# EasyEDA schematic SCH_stewart-platform.json

## Sheets
1 Sheet_1: TITLE: Sheet_1; REV: 1.0; Date: 2022-06-21; Sheet: 1/1; Drawn By: Sammy Oina; Company: Your Company
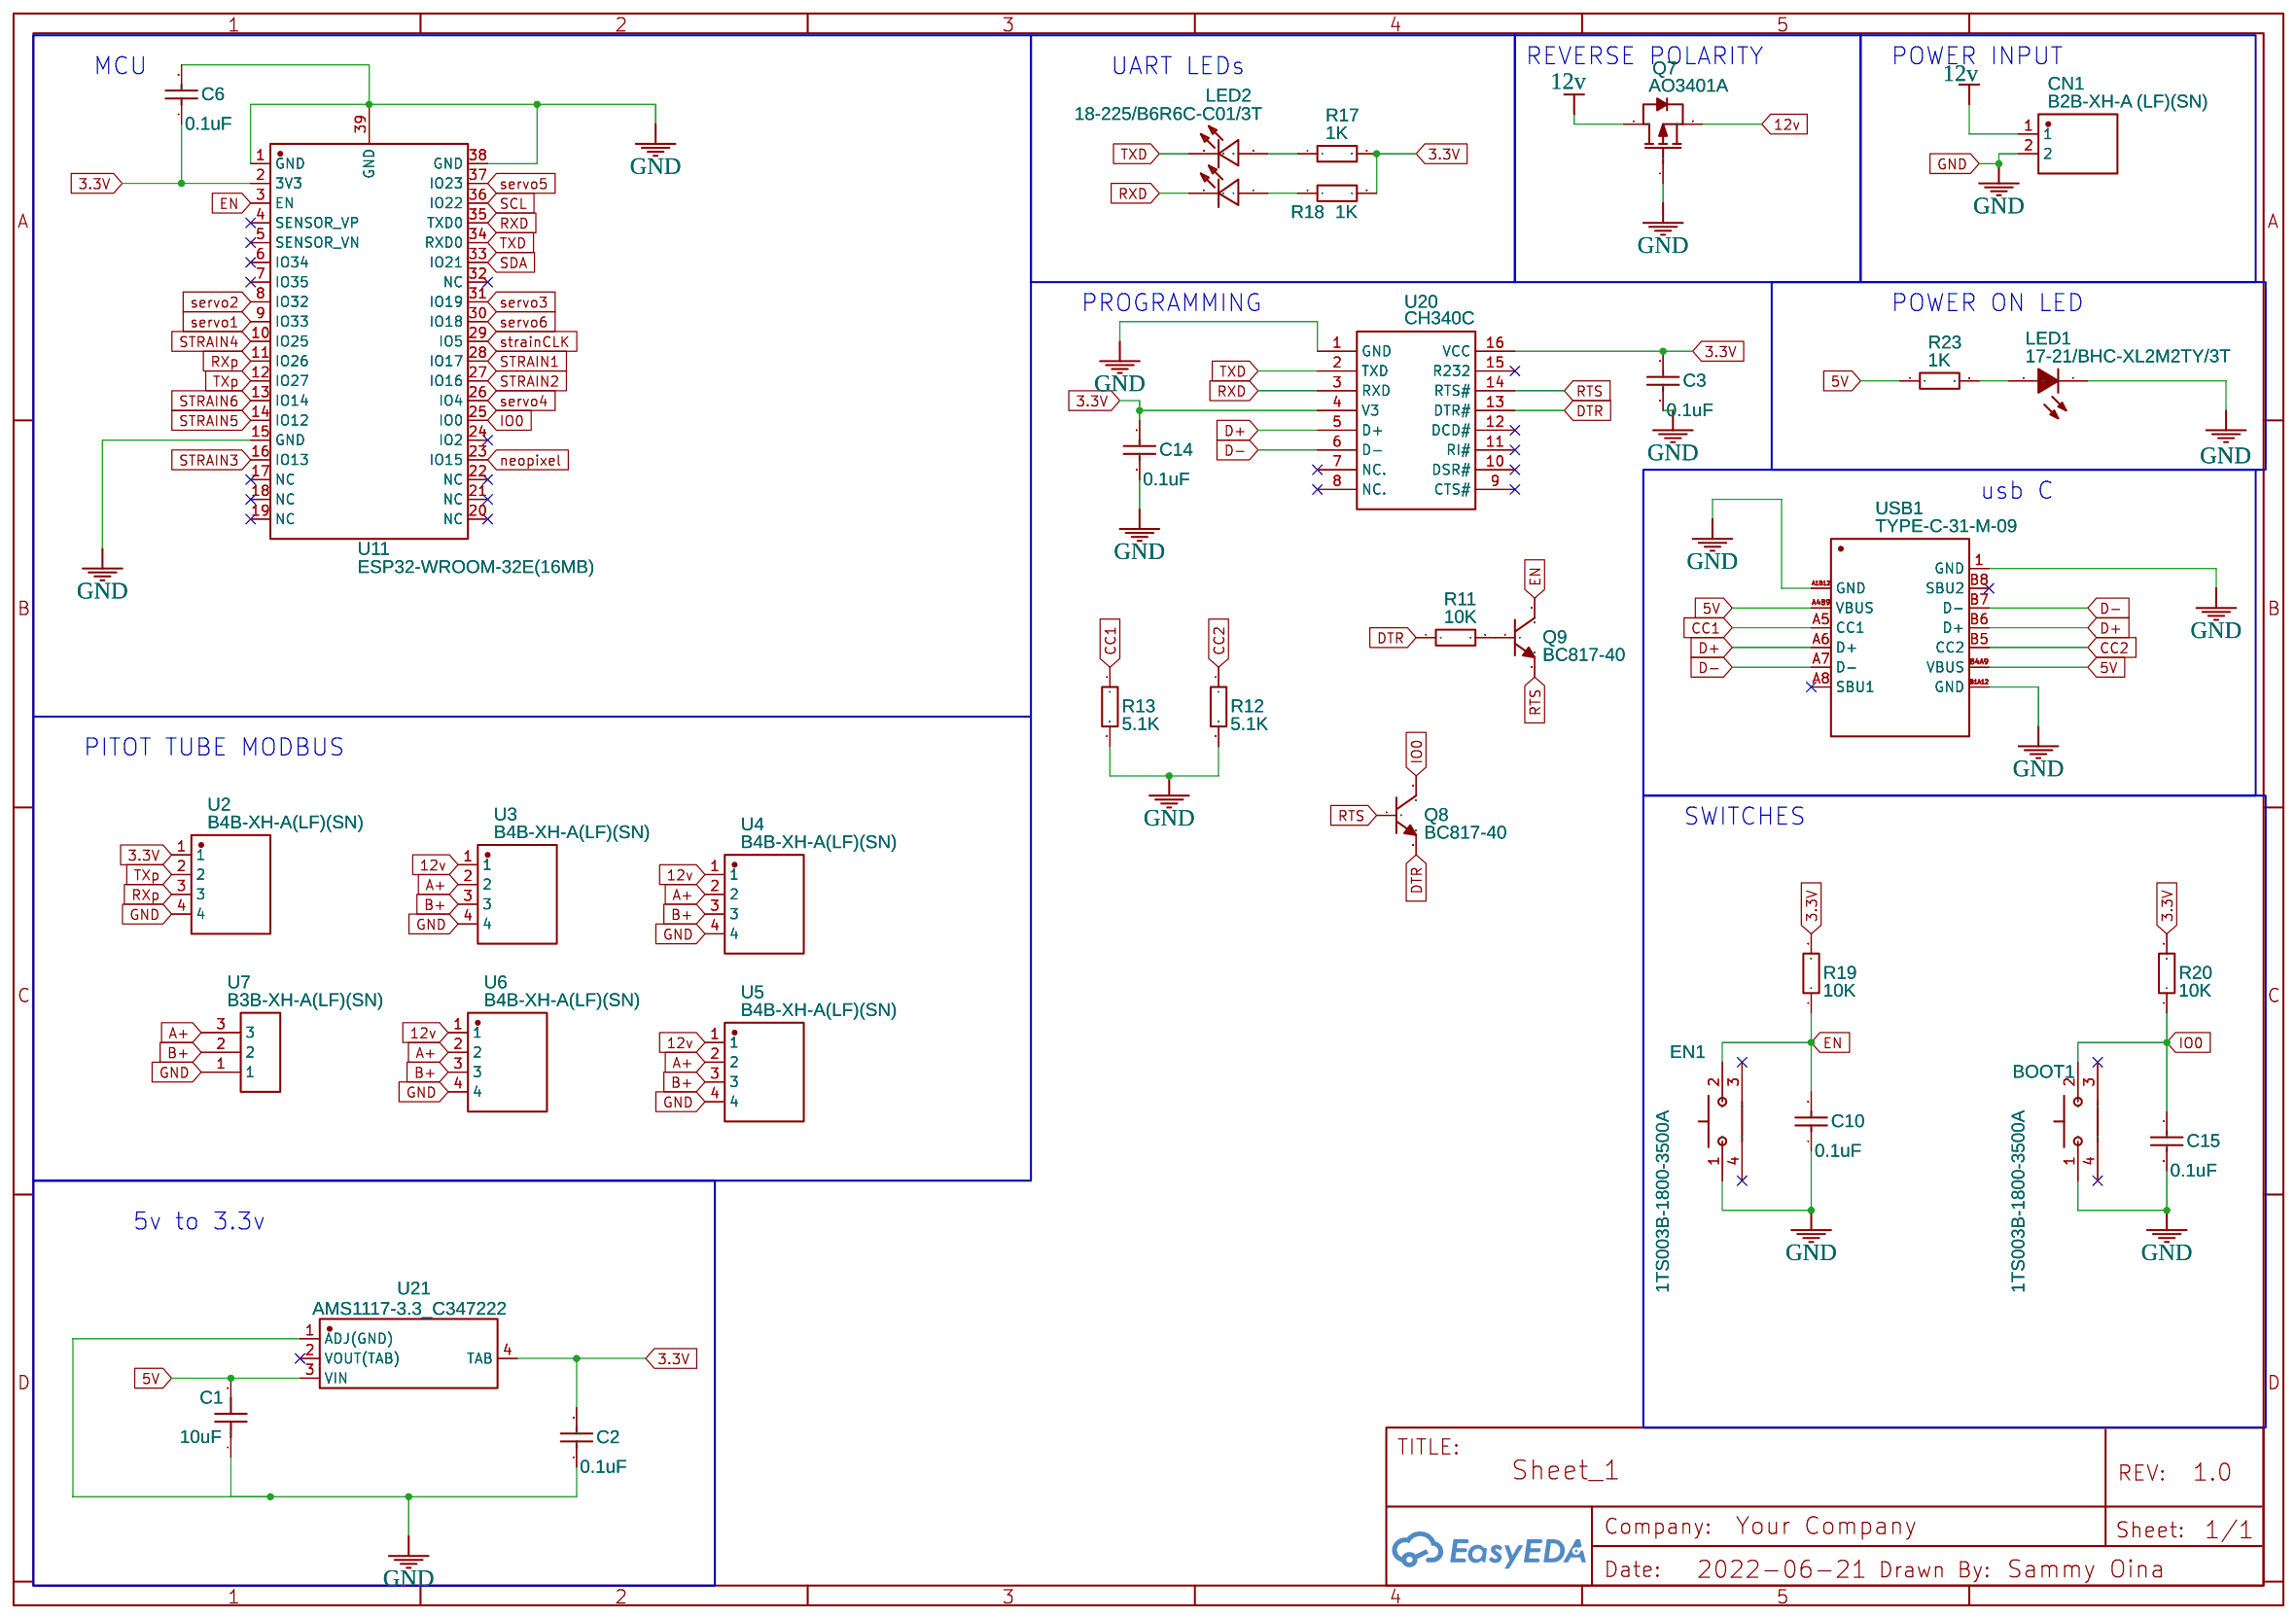
[diagram p0: Sheet_1]
2 Sheet_2: TITLE: Sheet_2; Date: 2022-06-29
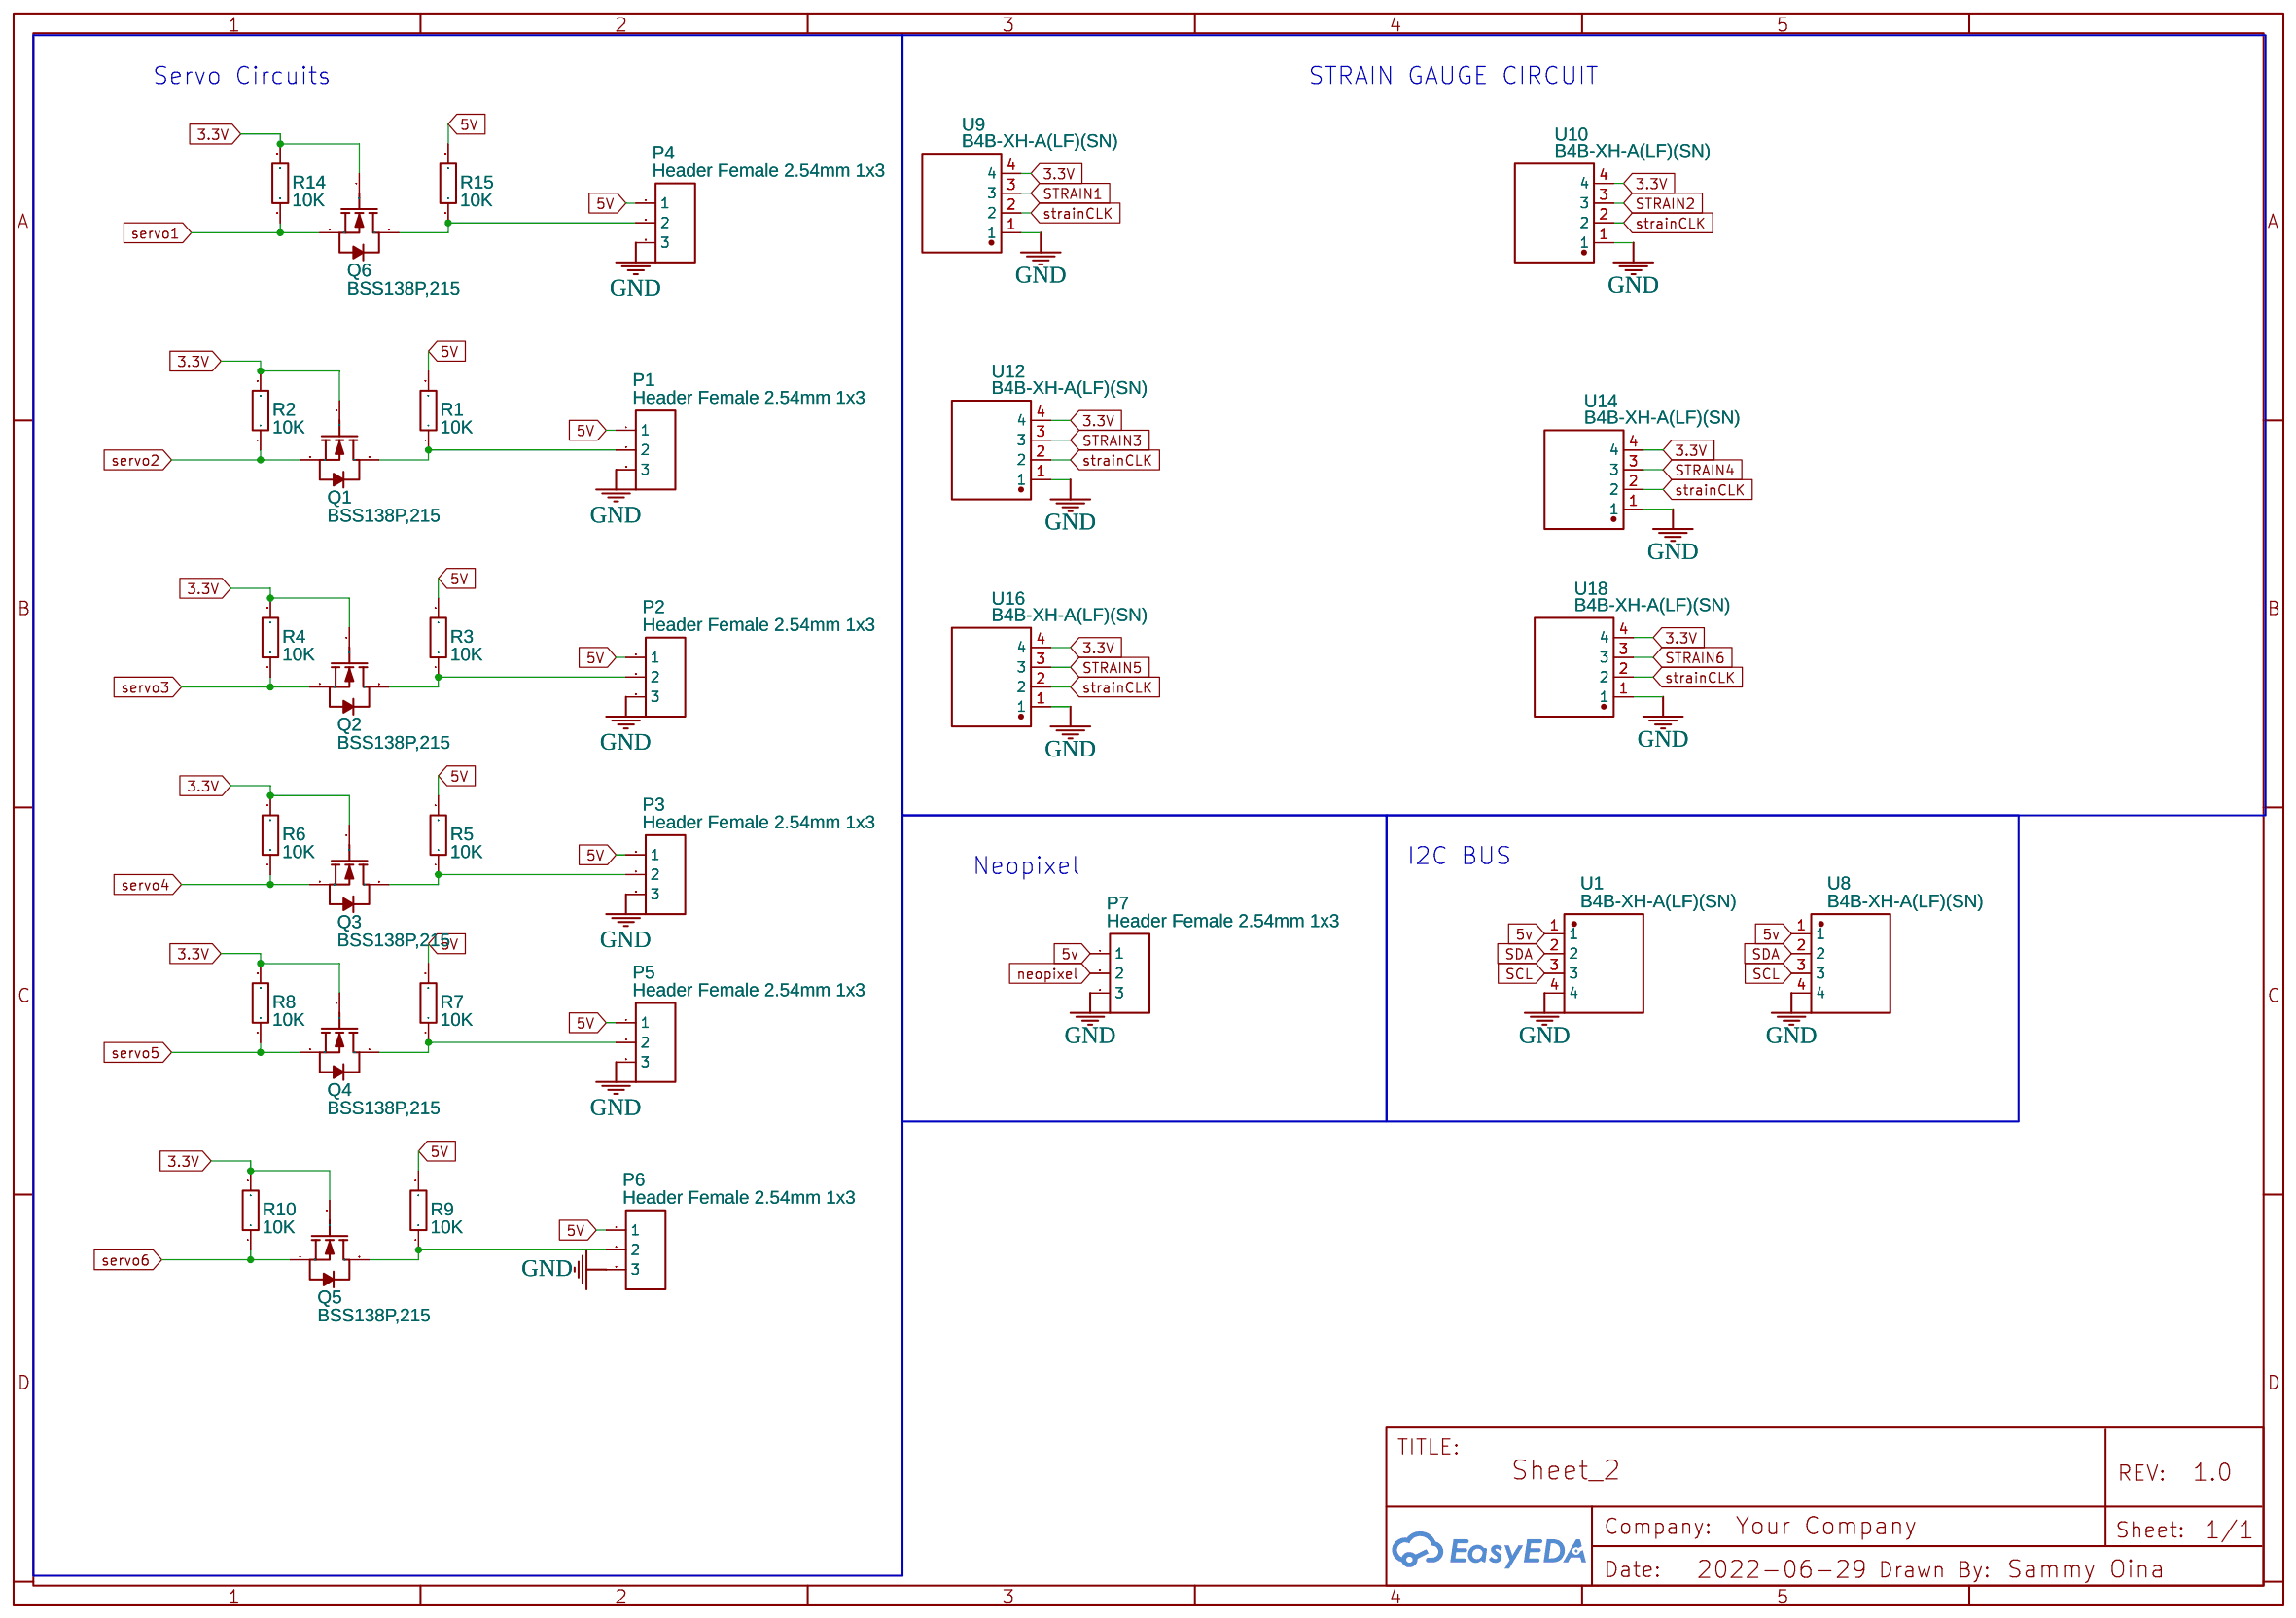
[diagram p1: Sheet_2]
3 Sheet_3: TITLE: Sheet_3; Date: 2022-07-07
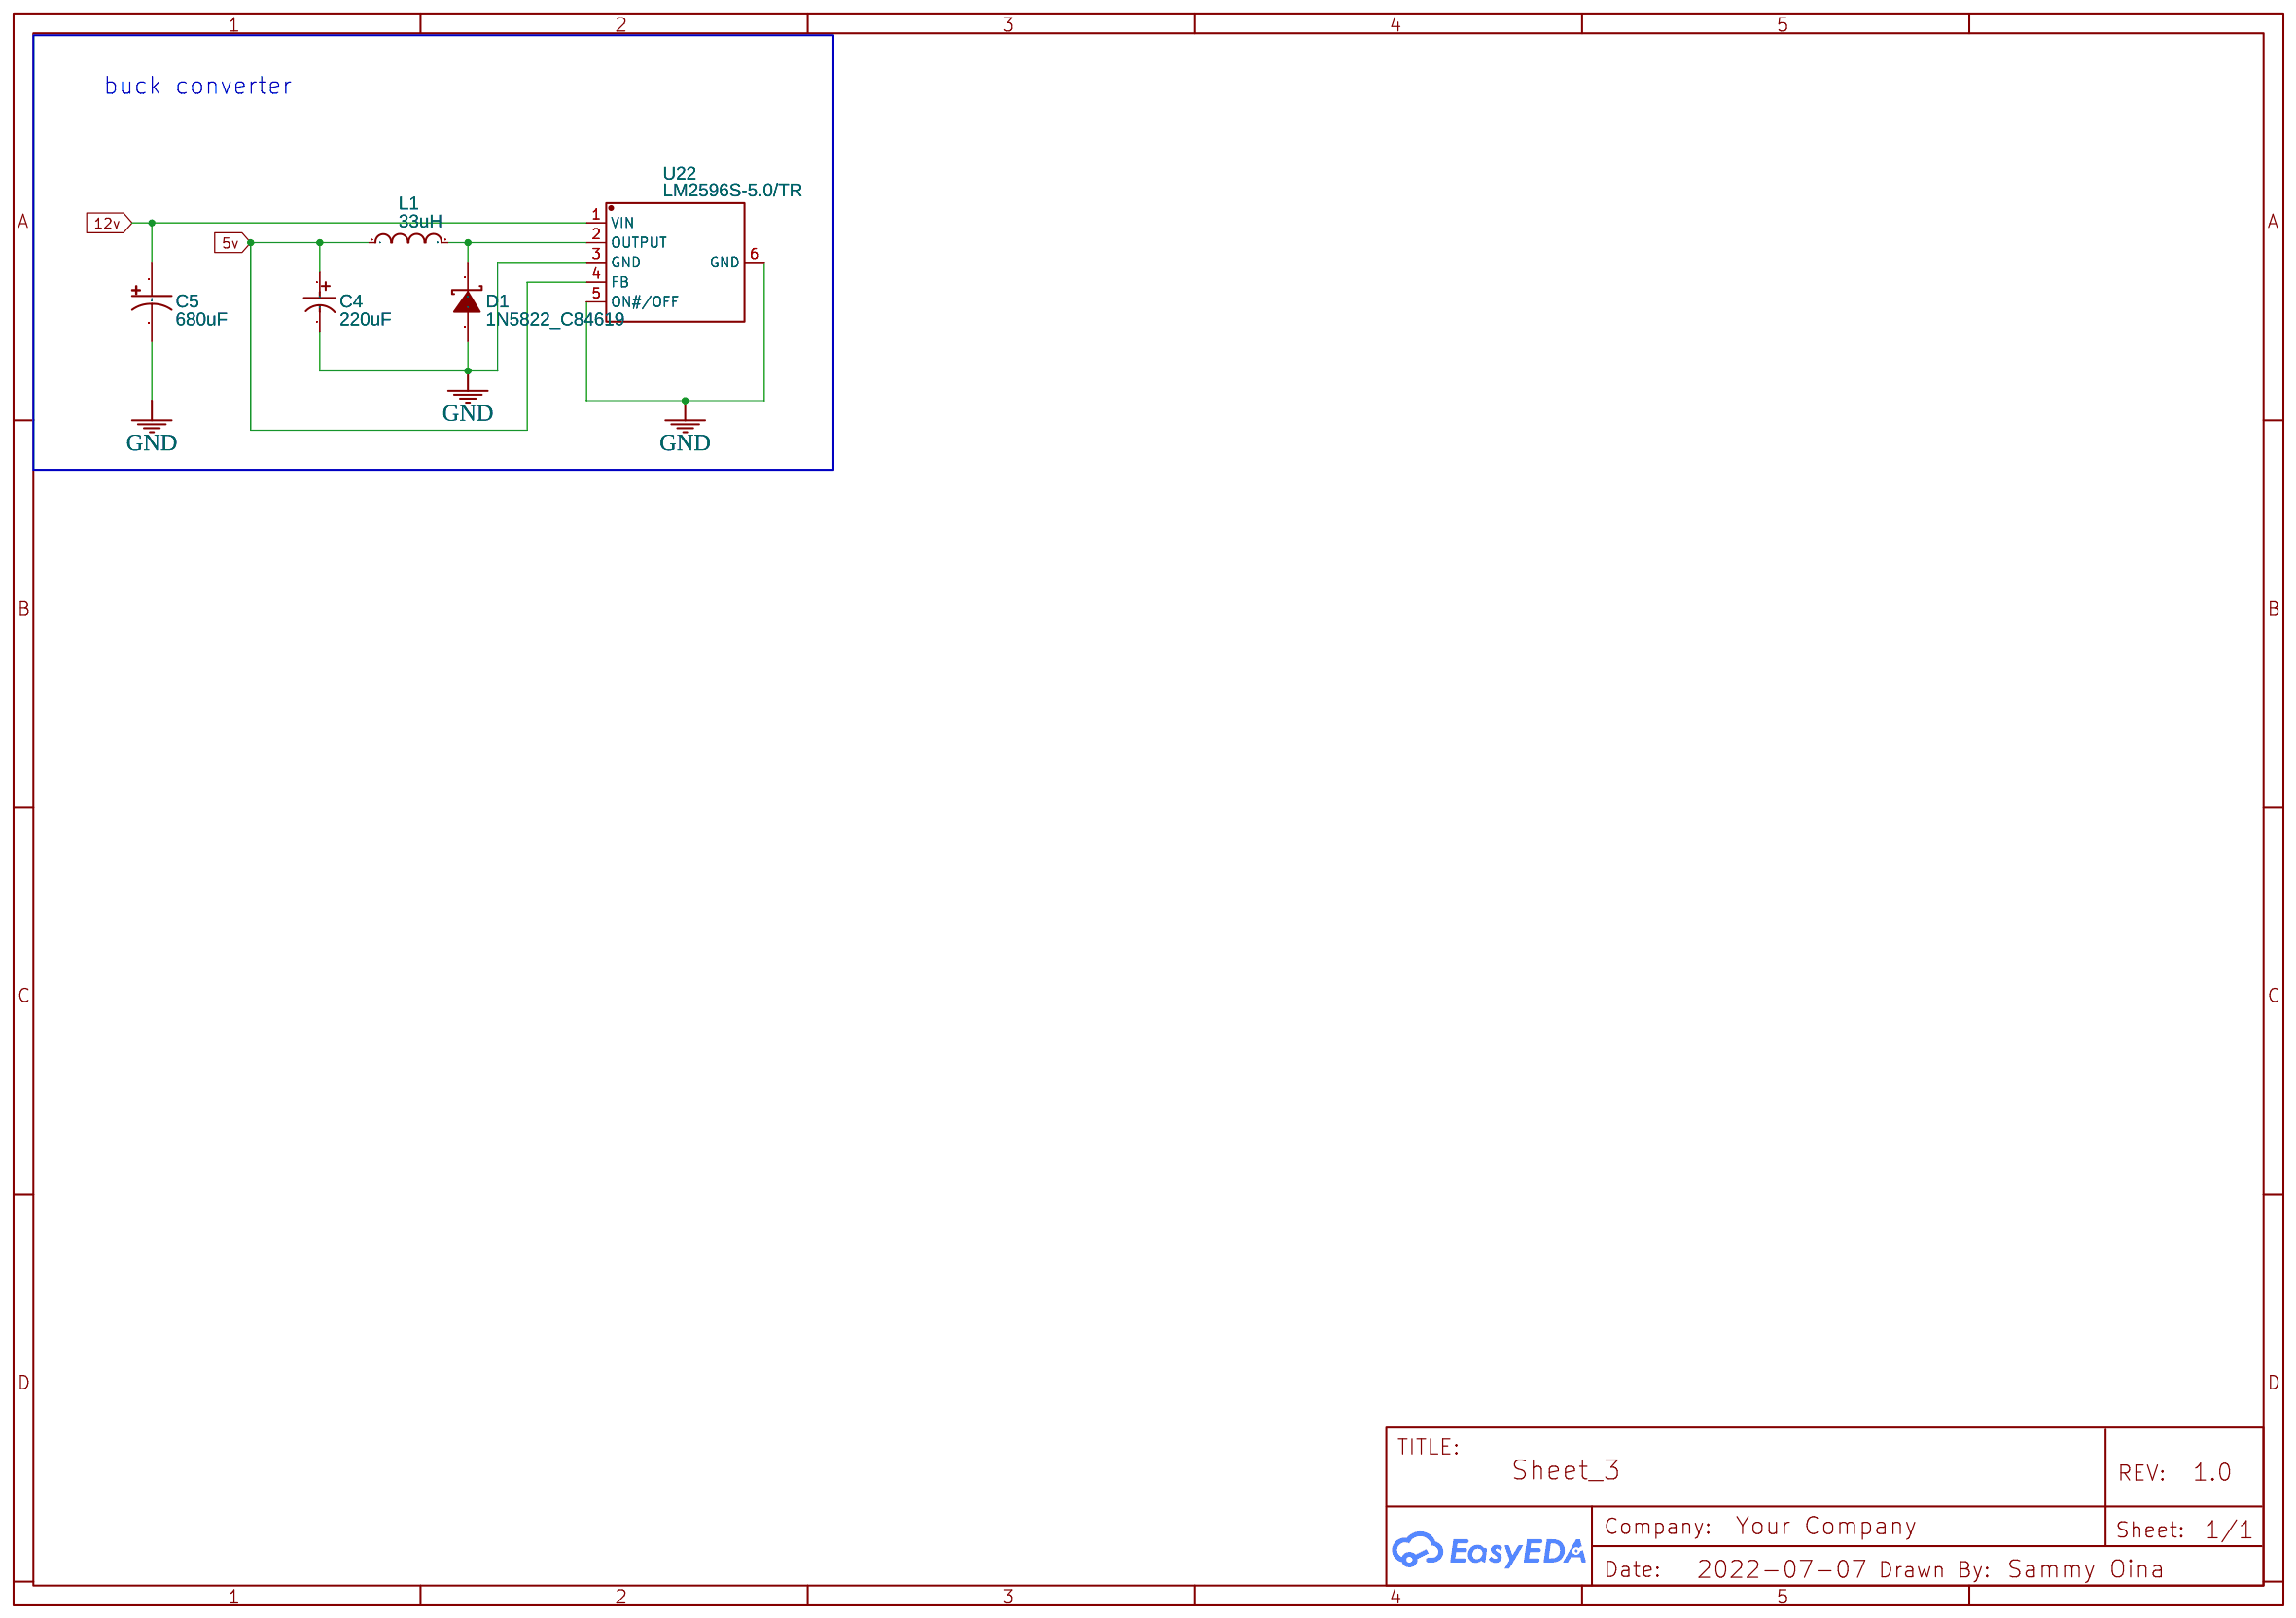
[diagram p2: Sheet_3]

## Parts
sheet Sheet_1
BOOT1  1TS003B-1800-3500A  [SW-SMD_1TS003B-XXXX-3500A-CT]
C1  10uF  [C0402]
C2  0.1uF  [C0603]
C3  0.1uF  [C0603]
C6  0.1uF  [C0603]
C10  0.1uF  [C0603]
C14  0.1uF  [C0603]
C15  0.1uF  [C0603]
CN1  B2B-XH-A (LF)(SN)  [CONN-TH_B2B-XH-A-LF-SN]
EN1  1TS003B-1800-3500A  [SW-SMD_1TS003B-XXXX-3500A-CT]
LED1  17-21/BHC-XL2M2TY/3T  [LED0805-RD]
LED2  18-225/B6R6C-C01/3T  [LED-SMD_4P-L1.6-W0.8-BR-RD]
Q7  AO3401A  [SOT-23_L2.9-W1.3-P1.90-LS2.4-BR]
Q8  BC817-40  [SOT-23-3_L2.9-W1.6-P1.90-LS2.8-BR]
Q9  BC817-40  [SOT-23-3_L2.9-W1.6-P1.90-LS2.8-BR]
R11  10K  [R0402]
R12  5.1K  [R0402]
R13  5.1K  [R0402]
R17  1K  [R0805]
R18  1K  [R0805]
R19  10K  [R0402]
R20  10K  [R0402]
R23  1K  [R0805]
U2  B4B-XH-A(LF)(SN)  [CONN-TH_B4B-XH-A-LF-SN]
U3  B4B-XH-A(LF)(SN)  [CONN-TH_B4B-XH-A-LF-SN]
U4  B4B-XH-A(LF)(SN)  [CONN-TH_B4B-XH-A-LF-SN]
U5  B4B-XH-A(LF)(SN)  [CONN-TH_B4B-XH-A-LF-SN]
U6  B4B-XH-A(LF)(SN)  [CONN-TH_B4B-XH-A-LF-SN]
U7  B3B-XH-A(LF)(SN)  [CONN-TH_3P-P2.50_B3B-XH-A-LF-SN]
U11  ESP32-WROOM-32E(16MB)  [WIFI-SMD_ESP32-WROOM-32E]
U20  CH340C  [SOP-16_L10.0-W3.9-P1.27-LS6.0-BL]
U21  AMS1117-3.3_C347222  [SOT-223_L6.7-W3.5-P2.30-BR]
USB1  TYPE-C-31-M-09  [USB-C-SMD_TYPE-C-31-M-09]
sheet Sheet_2
P1  Header Female 2.54mm 1x3  [HEADER FEMALE 2.54MM 3X1]
P2  Header Female 2.54mm 1x3  [HEADER FEMALE 2.54MM 3X1]
P3  Header Female 2.54mm 1x3  [HEADER FEMALE 2.54MM 3X1]
P4  Header Female 2.54mm 1x3  [HEADER FEMALE 2.54MM 3X1]
P5  Header Female 2.54mm 1x3  [HEADER FEMALE 2.54MM 3X1]
P6  Header Female 2.54mm 1x3  [HEADER FEMALE 2.54MM 3X1]
P7  Header Female 2.54mm 1x3  [HEADER FEMALE 2.54MM 3X1]
Q1  BSS138P,215  [SOT-23-3_L2.9-W1.6-P1.90-LS2.8-BR]
Q2  BSS138P,215  [SOT-23-3_L2.9-W1.6-P1.90-LS2.8-BR]
Q3  BSS138P,215  [SOT-23-3_L2.9-W1.6-P1.90-LS2.8-BR]
Q4  BSS138P,215  [SOT-23-3_L2.9-W1.6-P1.90-LS2.8-BR]
Q5  BSS138P,215  [SOT-23-3_L2.9-W1.6-P1.90-LS2.8-BR]
Q6  BSS138P,215  [SOT-23-3_L2.9-W1.6-P1.90-LS2.8-BR]
R1  10K  [R0603]
R2  10K  [R0603]
R3  10K  [R0603]
R4  10K  [R0603]
R5  10K  [R0603]
R6  10K  [R0603]
R7  10K  [R0603]
R8  10K  [R0603]
R9  10K  [R0603]
R10  10K  [R0603]
R14  10K  [R0603]
R15  10K  [R0603]
U1  B4B-XH-A(LF)(SN)  [CONN-TH_B4B-XH-A-LF-SN]
U8  B4B-XH-A(LF)(SN)  [CONN-TH_B4B-XH-A-LF-SN]
U9  B4B-XH-A(LF)(SN)  [CONN-TH_B4B-XH-A-LF-SN]
U10  B4B-XH-A(LF)(SN)  [CONN-TH_B4B-XH-A-LF-SN]
U12  B4B-XH-A(LF)(SN)  [CONN-TH_B4B-XH-A-LF-SN]
U14  B4B-XH-A(LF)(SN)  [CONN-TH_B4B-XH-A-LF-SN]
U16  B4B-XH-A(LF)(SN)  [CONN-TH_B4B-XH-A-LF-SN]
U18  B4B-XH-A(LF)(SN)  [CONN-TH_B4B-XH-A-LF-SN]
sheet Sheet_3
C4  220uF  [CAP-SMD_BD10.0-L10.3-W10.3-LS11.3-FD]
C5  680uF  [CAP-SMD_BD10.0-L10.3-W10.3-LS11.0-R-RD]
D1  1N5822_C84619  [DO-201AD_BD5.3-L8.4-P12.50-D1.4-RD]
L1  33uH  [IND-SMD_L7.0-W6.6_FXL0630]
U22  LM2596S-5.0/TR  [TO-263-5_L10.2-W8.6-P1.70-LS14.4-TL]

## Library data of the parts
BOOT1 EN1 = 1TS003B-1800-3500A: Supplier: LCSC; Supplier Part: C255809; Manufacturer: HYP; Contributor: LCSC; JLCPCB Part Class: Extended Part; Package Display: No
C1 = CL05A106MQ8NUB8: Supplier: LCSC; Supplier Part: C307416; Manufacturer: Samsung Electro-Mechanics; Contributor: LCSC; JLCPCB Part Class: Extended Part
C2 C3 C6 C10 C14 C15 = 0603B104K250: Supplier: LCSC; Manufacturer: WTC; Supplier Part: C83054; JLCPCB Part Class: Extended Part
CN1 = B2B-XH-A (LF)(SN): Supplier: LCSC; Supplier Part: C158012; Manufacturer: JST Sales America; Contributor: LCSC; JLCPCB Part Class: Extended Part
LED1 = 17-21/BHC-XL2M2TY/3T: Supplier: LCSC; Manufacturer: EVERLIGHT; Supplier Part: C72035; JLCPCB Part Class: Extended Part
LED2 = 18-225/B6R6C-C01/3T: Supplier: LCSC; Supplier Part: C282127; Manufacturer: Everlight Elec; Contributor: LCSC; JLCPCB Part Class: Extended Part
Q7 = AO3401A: Supplier: LCSC; Manufacturer: AOS; Supplier Part: C15127; JLCPCB Part Class: Basic Part
Q8 Q9 = BC817-40: Supplier: LCSC; Manufacturer: Hottech; Contributor: LCSC; Supplier Part: C181151; JLCPCB Part Class: Extended Part
R11 R19 R20 = 0402WGJ0103TCE: Supplier: LCSC; Manufacturer: UniOhm; Supplier Part: C25531; JLCPCB Part Class: Extended Part
R12 R13 = 0402WGF5101TCE: Supplier: LCSC; Manufacturer: UniOhm; Supplier Part: C25905; JLCPCB Part Class: Basic Part
R17 R18 R23 = PTFR0805B1K00N9: Supplier: LCSC; Supplier Part: C328437; Manufacturer: ResistorToday; Contributor: LCSC; JLCPCB Part Class: Extended Part
U1-U6 U8-U10 U12 U14 U16 U18 = B4B-XH-A(LF)(SN): Supplier: LCSC; Supplier Part: C144395; Manufacturer: JST Sales America; Contributor: LCSC; JLCPCB Part Class: Extended Part
U7 = B3B-XH-A(LF)(SN): Supplier: LCSC; Supplier Part: C144394; Manufacturer: JST Sales America; Contributor: LCSC; JLCPCB Part Class: Extended Part
U11 = ESP32-WROOM-32E(16MB): Supplier: LCSC; Supplier Part: C701343; Manufacturer: Espressif Systems; Contributor: LCSC; JLCPCB Part Class: Extended Part
U20 = CH340C: Supplier: LCSC; Manufacturer: WCH; Supplier Part: C84681; JLCPCB Part Class: Extended Part
U21 = AMS1117-3.3_C347222: Supplier: LCSC; Supplier Part: C347222; Manufacturer: Youtai Semiconductor Co., Ltd.; Manufacturer Part: AMS1117-3.3; Contributor: LCSC; JLCPCB Part Class: Extended Part
USB1 = TYPE-C-31-M-09: Supplier: LCSC; Supplier Part: C2689967; Manufacturer: 韩国韩荣; Contributor: LCSC; JLCPCB Part Class: Extended Part
P1-P7 = Header Female 2.54mm 1x3: Supplier Part: C146243; Supplier: LCSC; Manufacturer: Boom Precision Elec; Manufacturer Part: Header-Female-2.54_1x3; link: https://datasheet.lcsc.com/szlcsc/Boom-Precision-Elec-2-54mm-1-8P-Straight-Female-header_C27438.pdf; Contributor: JOnesy99
Q1-Q6 = BSS138P,215: Supplier: LCSC; Manufacturer: Nexperia; Supplier Part: C75547; JLCPCB Part Class: Extended Part
R1-R10 R14 R15 = 0603WAF4701T5E: Supplier: LCSC; Manufacturer: UniOhm; Supplier Part: C23162; JLCPCB Part Class: Basic Part
C4 = UCD1H221MNL1GS: Supplier: LCSC; Manufacturer: Nichicon; Contributor: LCSC; Supplier Part: C116211; JLCPCB Part Class: Extended Part
C5 = VEJ681M1CTR-1010: Supplier: LCSC; Manufacturer: LELON; Contributor: LCSC; Supplier Part: C134782; JLCPCB Part Class: Extended Part
D1 = 1N5822_C84619: Supplier: LCSC; Manufacturer Part: 1N5822; Manufacturer: STARSEA; Supplier Part: C84619; JLCPCB Part Class: Extended Part
L1 = MCW-0630-330-N2: Supplier: LCSC; Supplier Part: C177254; Manufacturer: Hk-hotline; Contributor: LCSC; JLCPCB Part Class: Extended Part
U22 = LM2596S-5.0/TR: Supplier: LCSC; Supplier Part: C194349; Manufacturer: HGSEMI; Contributor: LCSC; JLCPCB Part Class: Extended Part

## Nets
3.3V: C2.2 C3.2 C6.1 C14.2 Q1.1(G) Q2.1(G) Q3.1(G) Q4.1(G) Q5.1(G) Q6.1(G) R2.2 R4.2 R6.2 R8.2 R10.2 R14.2 R17.2 R18.2 R19.2 R20.2 U2.1 U9.4 U10.4 U11.2(3V3) U12.4 U14.4 U16.4 U18.4 U20.4(V3) U20.16(VCC) U21.4(TAB)
5V: C1.2 P1.1 P2.1 P3.1 P4.1 P5.1 P6.1 R1.2 R3.2 R5.2 R7.2 R9.2 R15.2 R23.1 U21.3(VIN) USB1.A4B9(VBUS) USB1.B4A9(VBUS)
5v: C4.1 L1.1 P7.1 U1.1 U8.1 U22.4(FB)
12v: C5.1 CN1.1 Q7.2(S) Q7.3(D) U3.1 U4.1 U5.1 U6.1 U22.1(VIN)
GND: BOOT1.1 C1.1 C2.1 C3.1 C4.2 C5.2 C6.2 C10.1 C14.1 C15.1 CN1.2 D1.2(A) EN1.1 LED1.1(-) P1.3 P2.3 P3.3 P4.3 P5.3 P6.3 P7.3 Q7.1(G) R12.2 R13.2 U1.4 U2.4 U3.4 U4.4 U5.4 U6.4 U7.1 U8.4 U9.1 U10.1 U11.1(GND) U11.15(GND) U11.38(GND) U11.39(GND) U12.1 U14.1 U16.1 U18.1 U20.1(GND) U21.1(ADJ(GND)) U22.3(GND) U22.5(ON#/OFF) U22.6(GND) USB1.1(GND) USB1.A1B12(GND) USB1.B1A12(GND)
A+: U3.2 U4.2 U5.2 U6.2 U7.3
B+: U3.3 U4.3 U5.3 U6.3 U7.2
CC1: R13.1 USB1.A5(CC1)
CC2: R12.1 USB1.B5(CC2)
D+: U20.5(D+) USB1.A6(D+) USB1.B6(D+)
D-: U20.6(D-) USB1.A7(D-) USB1.B7(D-)
DTR: Q8.2 R11.1 U20.13(DTR#)
EN: C10.2 EN1.2 Q9.3 R19.1 U11.3(EN)
IO0: BOOT1.2 C15.2 Q8.3 R20.1 U11.25(IO0)
neopixel: P7.2 U11.23(IO15)
RTS: Q8.1 Q9.2 U20.14(RTS#)
RXD: LED2.4 U11.35(TXD0) U20.3(RXD)
RXp: U2.3 U11.11(IO26)
SCL: U1.3 U8.3 U11.36(IO22)
SDA: U1.2 U8.2 U11.33(IO21)
servo1: Q6.2(S) R14.1 U11.9(IO33)
servo2: Q1.2(S) R2.1 U11.8(IO32)
servo3: Q2.2(S) R4.1 U11.31(IO19)
servo4: Q3.2(S) R6.1 U11.26(IO4)
servo5: Q4.2(S) R8.1 U11.37(IO23)
servo6: Q5.2(S) R10.1 U11.30(IO18)
STRAIN1: U9.3 U11.28(IO17)
STRAIN2: U10.3 U11.27(IO16)
STRAIN3: U11.16(IO13) U12.3
STRAIN4: U11.10(IO25) U14.3
STRAIN5: U11.14(IO12) U16.3
STRAIN6: U11.13(IO14) U18.3
strainCLK: U9.2 U10.2 U11.29(IO5) U12.2 U14.2 U16.2 U18.2
TXD: LED2.3 U11.34(RXD0) U20.2(TXD)
TXp: U2.2 U11.12(IO27)
Net-(D1-1): D1.1(C) L1.2 U22.2(OUTPUT)
Net-(LED1-2): LED1.2(+) R23.2
Net-(LED2-1): LED2.1 R18.1
Net-(LED2-2): LED2.2 R17.1
Net-(P1-2): P1.2 Q1.3(D) R1.1
Net-(P2-2): P2.2 Q2.3(D) R3.1
Net-(P3-2): P3.2 Q3.3(D) R5.1
Net-(P4-2): P4.2 Q6.3(D) R15.1
Net-(P5-2): P5.2 Q4.3(D) R7.1
Net-(P6-2): P6.2 Q5.3(D) R9.1
Net-(Q9-1): Q9.1 R11.2

Not connected (* = marked no-connect by the designer): BOOT1 3* 4*; EN1 3* 4*; U11 4(SENSOR_VP)* 5(SENSOR_VN)* 6(IO34)* 7(IO35)* 17(NC)* 18(NC)* 19(NC)* 20(NC)* 21(NC)* 22(NC)* 24(IO2)* 32(NC)*; U20 7(NC.)* 8(NC.)* 9(CTS#)* 10(DSR#)* 11(RI#)* 12(DCD#)* 15(R232)*; U21 2(VOUT(TAB))*; USB1 A8(SBU1)* B8(SBU2)*

## Notes on the sheets
sheet 1
- REVERSE POLARITY
- POWER INPUT
- MCU
- UART LEDs
- PROGRAMMING
- POWER ON LED
- usb C
- PITOT TUBE MODBUS
- SWITCHES
- 5v to 3.3v
sheet 2
- Servo Circuits
- STRAIN GAUGE CIRCUIT
- Neopixel
- I2C BUS
sheet 3
- buck converter
